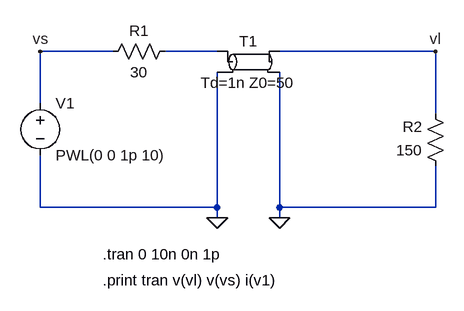
[diagram p0: schematic hw1_p5_eantunano.asc]
hw1_p5_eantunano.asc, the LTspice schematic file:
Version 4
SHEET 1 880 680
WIRE 16 -32 -96 -32
WIRE 176 -32 96 -32
WIRE 512 -32 272 -32
WIRE -96 48 -96 -32
WIRE 512 64 512 -32
WIRE -96 208 -96 128
WIRE 176 208 176 0
WIRE 176 208 -96 208
WIRE 272 208 272 0
WIRE 512 208 512 144
WIRE 512 208 272 208
WIRE 176 224 176 208
WIRE 272 224 272 208
FLAG 176 224 0
FLAG 512 -32 vl
FLAG -96 -32 vs
FLAG 272 224 0
SYMBOL voltage -96 32 R0
WINDOW 123 0 0 Left 0
WINDOW 39 0 0 Left 0
SYMATTR InstName V1
SYMATTR Value PWL(0 0 1p 10)
SYMBOL res 112 -48 R90
WINDOW 0 0 56 VBottom 2
WINDOW 3 32 56 VTop 2
SYMATTR InstName R1
SYMATTR Value 30
SYMBOL res 528 160 R180
WINDOW 0 36 76 Left 2
WINDOW 3 36 40 Left 2
SYMATTR InstName R2
SYMATTR Value 150
SYMBOL tline 224 -16 R0
SYMATTR InstName T1
SYMATTR Value Td=1n Z0=50
TEXT 0 280 Left 2 !.tran 0 10n 0n 1p
TEXT 0 320 Left 2 !.print tran v(vl) v(vs) i(v1)

The netlist it stands for:
* hw1_p5_eantunano.asc
V1 vs 0 PWL(0 0 1p 10)
R1 N001 vs 30
R2 0 vl 150
T1 N001 0 vl 0 Td=1n Z0=50
.tran 0 10n 0n 1p
.print tran v(vl) v(vs) i(v1)
.backanno
.end